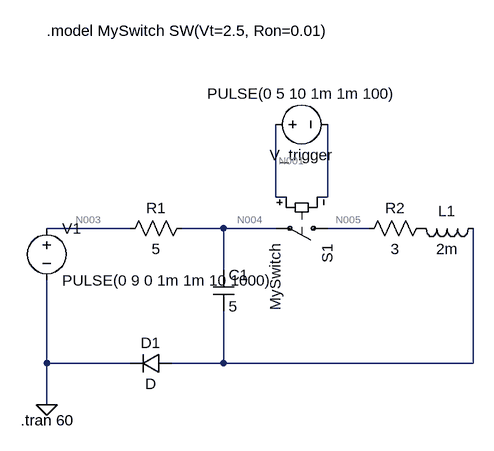
[diagram p0: schematic Draft2.asc]
Draft2.asc, the LTspice schematic file:
Version 4.1
SHEET 1 880 680
WIRE 432 -16 432 -128
WIRE 448 -16 432 -16
WIRE 512 -16 512 -128
WIRE 512 -16 496 -16
WIRE 208 32 80 32
WIRE 352 32 288 32
WIRE 432 32 352 32
WIRE 576 32 512 32
WIRE 352 96 352 32
WIRE 80 240 80 112
WIRE 208 240 80 240
WIRE 352 240 352 160
WIRE 352 240 272 240
WIRE 736 240 736 32
WIRE 736 240 352 240
WIRE 80 304 80 240
FLAG 80 304 0
SYMBOL voltage 80 16 R0
WINDOW 123 0 0 Left 0
WINDOW 39 0 0 Left 0
SYMATTR InstName V1
SYMATTR Value PULSE(0 9 0 1m 1m 10 1000)
SYMBOL res 304 16 R90
WINDOW 0 0 56 VBottom 2
WINDOW 3 32 56 VTop 2
SYMATTR InstName R1
SYMATTR Value 5
SYMBOL cap 336 96 R0
SYMATTR InstName C1
SYMATTR Value 5
SYMATTR SpiceLine Rser=0.06
SYMBOL diode 272 224 R90
WINDOW 0 0 32 VBottom 2
WINDOW 3 32 32 VTop 2
SYMATTR InstName D1
SYMBOL res 560 48 R270
WINDOW 0 32 56 VTop 2
WINDOW 3 0 56 VBottom 2
SYMATTR InstName R2
SYMATTR Value 3
SYMBOL ind 752 16 R90
WINDOW 0 5 56 VBottom 2
WINDOW 3 32 56 VTop 2
SYMATTR InstName L1
SYMATTR Value 2m
SYMBOL sw 528 32 R90
SYMATTR InstName S1
SYMATTR Value MySwitch
SYMBOL voltage 416 -128 R270
WINDOW 0 -32 56 VBottom 2
WINDOW 3 32 56 VTop 2
WINDOW 123 0 0 Left 0
WINDOW 39 0 0 Left 0
SYMATTR InstName V_trigger
SYMATTR Value PULSE(0 5 10 1m 1m 100)
TEXT 80 -272 Left 2 !.model MySwitch SW(Vt=2.5, Ron=0.01)
TEXT 40 328 Left 2 !.tran 60

The netlist it stands for:
* Draft2.asc
V1 N003 0 PULSE(0 9 0 1m 1m 10 1000)
R1 N004 N003 5
C1 N004 N006 5 Rser=0.06
D1 N006 0 D
R2 N005 P001 3
L1 N006 P001 2m
S1 N005 N004 N001 N002 MySwitch
V_trigger N001 N002 PULSE(0 5 10 1m 1m 100)
.model D D
.lib standard.dio
.model MySwitch SW(Vt=2.5, Ron=0.01)
.tran 60
.backanno
.end

* Results of the author's LTspice run, read from the files saved beside the schematic
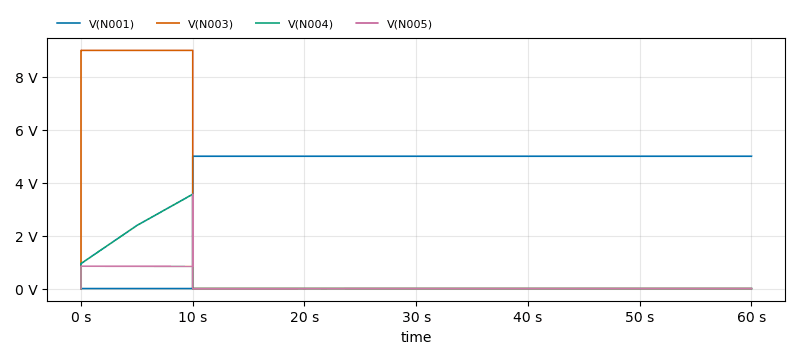
[diagram p1: Transient Analysis of Draft2.asc, plotted from the saved traces]
* Transient Analysis, 1 run:
*   V(N001): min 0 V, max 5 V, average 4.167 V, rms 4.564 V, last 5 V
*   V(N003): min 0 V, max 9 V, average 1.5 V, rms 3.674 V, last 0 V
*   V(N004): min 0 V, max 3.565 V, average 386.5 mV, rms 1.02 V, last 0 V
*   V(N005): min -8.661 mV, max 3.565 V, average 138.1 mV, rms 343.7 mV, last -334.3 µV